# EAGLE design lightbuddy-transmitter (EAGLE 7.2.0)
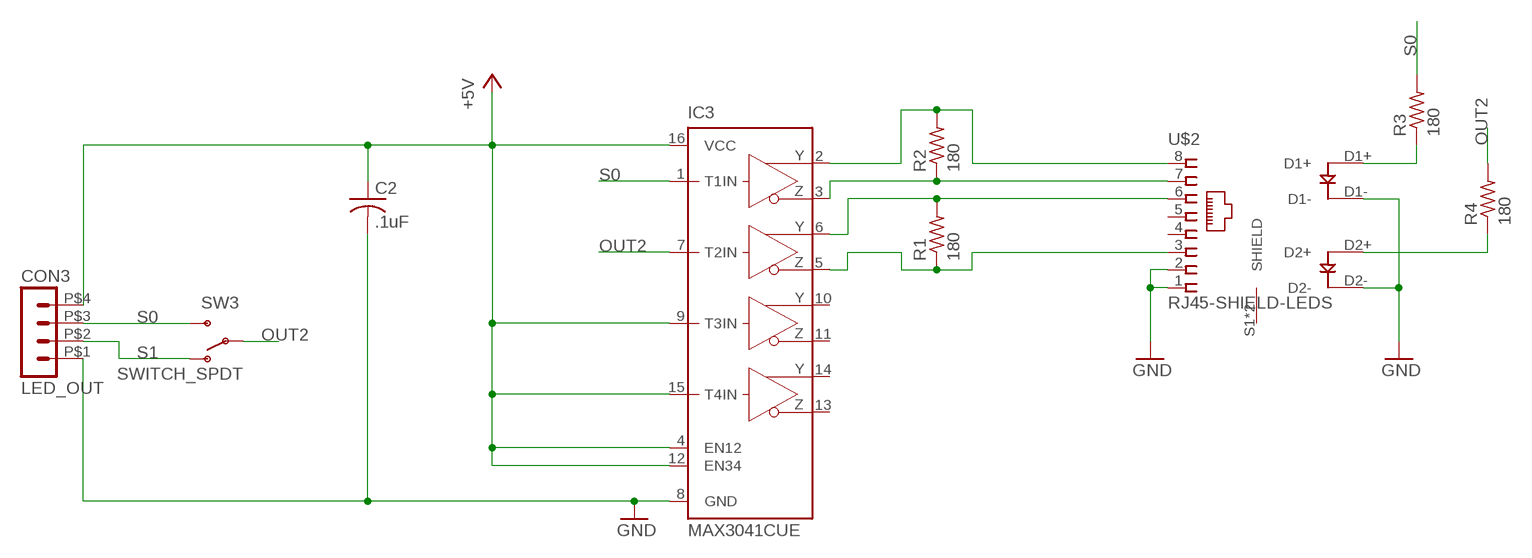
[diagram p0: schematic, sheet 1]

## Parts
C2  .1uF  C-USC0603  [C0603]
CON3  LED_OUT  4-PIN_DUPONT  [DUPONT-4P]
IC3  MAX3041CUE  [TSSOP16]
R1  180  R-US_R0603  [R0603]
R2  180  R-US_R0603  [R0603]
R3  180  R-US_R0603  [R0603]
R4  180  R-US_R0603  [R0603]
SW3  SWITCH_SPDT  [SWITCH_6P-2POS]
U$2  RJ45-SHIELD-LEDS  [RJ45-SHIELD-LEDS-ALT]

## Nets
+5V: C2.1 CON3.P$4 IC3.4(EN12) IC3.9(T3IN) IC3.12(EN34) IC3.15(T4IN) IC3.16(VCC)
GND: C2.2 CON3.P$1 IC3.8(GND) U$2.1 U$2.2 U$2.D1- U$2.D2-
N$1: R3.1 U$2.D1+
N$5: R4.1 U$2.D2+
N$14: IC3.5(Z2) R1.1 U$2.3
N$19: IC3.2(Y1) R2.2 U$2.8
N$20: IC3.3(Z1) R2.1 U$2.7
N$21: IC3.6(Y2) R1.2 U$2.6
OUT2: IC3.7(T2IN) R4.2 SW3.P0(P) SW3.P1(P)
S0: CON3.P$3 IC3.1(T1IN) R3.2 SW3.S0(S) SW3.S1(S)
S1: CON3.P$2 SW3.O0(O) SW3.O1(O)
Unconnected: IC3.10(Y3) IC3.11(Z3) IC3.13(Z4) IC3.14(Y4) U$2.4 U$2.5 U$2.S1(SHIELD) U$2.S2(SHIELD)

## Library data of the parts
C2 = adafruit:C-US: CAPACITOR, American symbol
CON3 = blinkinlabs:4-PIN_DUPONT: PIN HEADER
IC3 = maxim:MAX30*: ±10kV ESD-Protected, Quad 5V RS-485/RS-422 Transmitters Source: www.maxim-ic.com .. MAX3040-MAX3045.pdf; MPN: MAX3041CUE+; OC_FARNELL: unknown; OC_NEWARK: 73K8525
R1-R4 = adafruit:R-US_: RESISTOR, American symbol
SW3 = blinkinlabs:SWITCH_SPDT
U$2 = LEDscape:RJ45-SHIELD-LEDS

## Net classes
1 power: width 0.254 mm, drill 0.35 mm

## Board
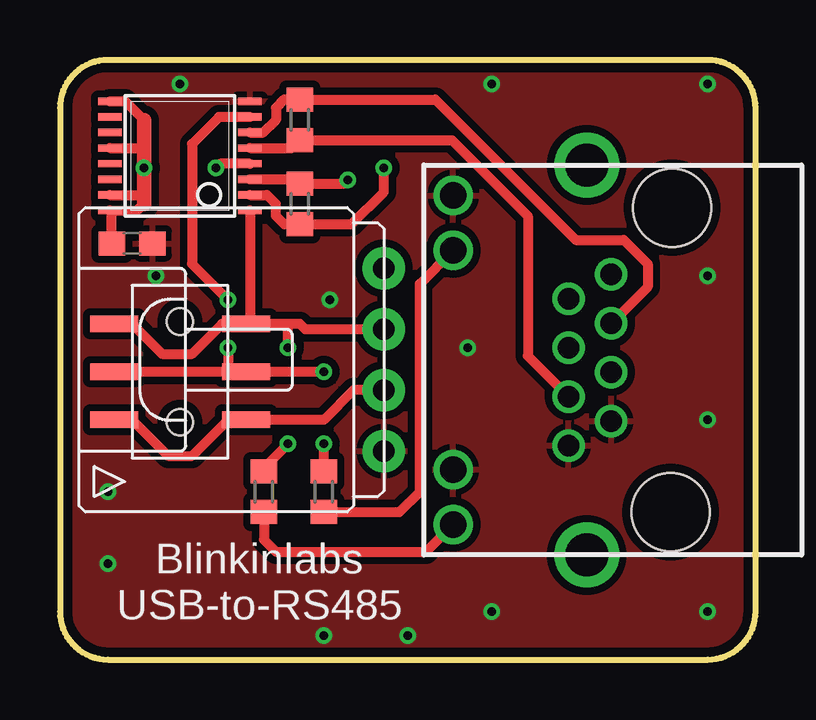
[diagram p1: board, top side]
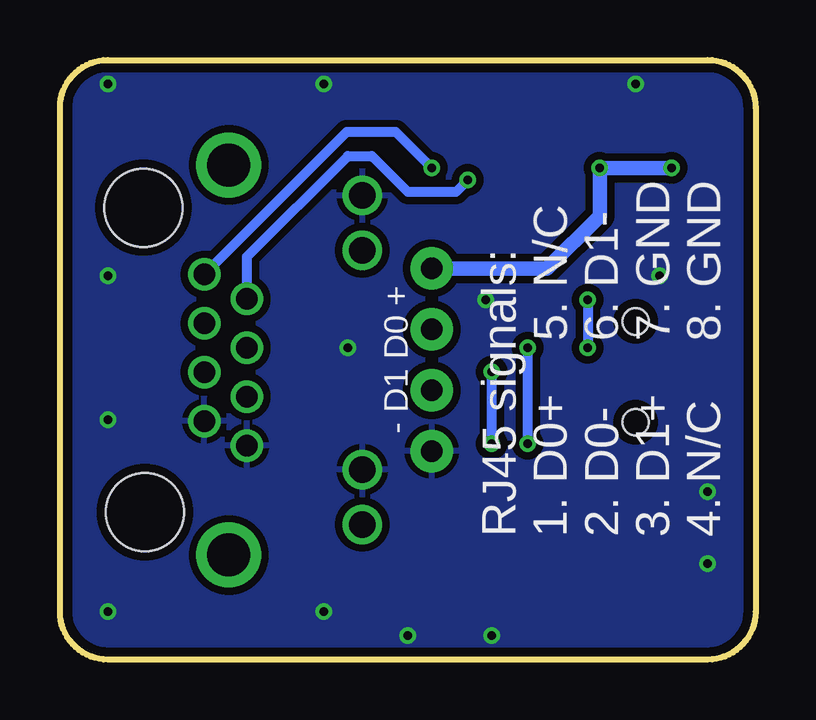
[diagram p2: board, bottom side, seen from below]

Size 29 x 25 mm. Coordinates in mm from the lower left corner, seen from the top.
Outline: 0,23 0,2 arc90 2,0 27,0 arc90 29,2 29,23 arc90 27,25 2,25 arc90 0,23
Copper layers (1*16): Top 0.0356mm / dielectric 1.5011mm / Bottom 0.0356mm
Design rules "LaenPCBOrder *": minimum track width 6mil, minimum drill 13mil, track to track 6mil, track to pad 6mil, pad to pad 6mil, via to via 6mil, smd to smd 6mil, copper to edge 15mil, drill to drill 6mil, minimum pad ring 7mil, minimum via ring 7mil, stop-mask expansion 4mil, vias tented up to drill 2mm, thermal gap 10mil

### Footprints (pad centres in the part's own frame; a part is rotated, then mirrored left to right if it is on the bottom)
C0603 = smd 1.1 x 1: 1 -0.85,0; 2 0.85,0
DUPONT-4P = drill 0.9 pad 1.778: P$1 -3.81,0; P$2 -1.27,0; P$3 1.27,0; P$4 3.81,0
TSSOP16 = smd 0.305 x 0.991: 1 -2.275,-2.918; 2 -1.625,-2.918; 3 -0.975,-2.918; 4 -0.325,-2.918; 5 0.325,-2.918; 6 0.975,-2.918; 7 1.625,-2.918; 8 2.275,-2.918; 9 2.275,2.918; 10 1.625,2.918; 11 0.975,2.918; 12 0.325,2.918; 13 -0.325,2.918; 14 -0.975,2.918; 15 -1.625,2.918; 16 -2.275,2.918
R0603 = smd 1 x 1.1: 1 -0.85,0; 2 0.85,0
SWITCH_6P-2POS = smd 0.7 x 2: O0 -2,2.75; O1 -2,-2.75; P0 0,2.75; P1 0,-2.75; S0 2,2.75; S1 2,-2.75 | hole 1.1: -2.1,0; 2.1,0
RJ45-SHIELD-LEDS-ALT = drill 0.9: 1 -3.57,0.76; 2 -2.55,-1.02; 3 -1.53,0.76; 4 -0.51,-1.02; 5 0.51,0.76; 6 1.53,-1.02; 7 2.55,0.76; 8 3.57,-1.02 | drill 1.1: D1+ -6.86,5.57; D1- -4.57,5.57; D2+ 4.57,5.57; D2- 6.86,5.57 | drill 1.8: S1 -8.13,0; S2 8.13,0 | hole 3.25: -6.35,-3.5; 6.35,-3.56

### Placement (x,y rotation side)
C2  3.01,17.35 0 top
CON3  13.5,12.5 90 top
IC3  5,21 90 top
R1  10,22.5 90 top
R2  10,19 270 top
R3  8.5,7 90 top
R4  11,7 90 top
SW3  5,12 90 top
U$2  21.96,12.49 90 top

### Tracks (layer width: path | path; a pad name or v marks a point on that pad's centre or on a via)
+5V  (via drill 0.35)
  Top 0.406: IC3.9 2.72,23.27 3.5,22.5 | IC3.12 3.33,21.32 3.5,21.5 | IC3.15 3.38,19.38 3.5,19.5 | 3.5,19 3.22,18.73 IC3.16 2.16,18.65 C2.1 | IC3.4 6.68,20.68 v6.5,20.5
  Top 0.61: 3.5,22.5 3.5,21.5 v3.5,20.5 3.5,19.5 3.5,19
  Bottom 0.61: CON3.P$4 8.69,16.31 6.5,18.5 6.5,20 v6.5,20.5 v3.5,20.5
GND  (via drill 0.35)
  other vias: 2,4 2,7 11,1 14.5,1 18,2 27,2 27,10 27,16 27,24 18,24 5,24 4,16 11.25,15 17,13
  pour Bottom (isolate 0.305): 0,0 0,25 29,25 29,0
  pour Top (isolate 0.305): 0,0 0,25 29,25 29,0
N$1
  Top 0.406: R3.1 8.5,5 9,4.5 15.26,4.5 U$2.D1+
N$5
  Top 0.406: R4.1 14.15,6.15 15,7 15,15.67 U$2.D2+
N$14
  Top 0.406: U$2.3 19.5,12.66 19.5,18.5 16.35,21.65 R1.1 9.68,21.32 IC3.5
N$19  (via drill 0.35)
  Top 0.406: v13.5,20.5 13.5,19.5 12.15,18.15 R2.2 9.35,18.15 9,18.5 9,19 8.62,19.38 IC3.2
  Bottom 0.406: v13.5,20.5 15,22 17.04,22 U$2.8
N$20  (via drill 0.35)
  Top 0.406: v12,20 11.85,19.85 R2.1 9.82,20.02 IC3.3
  Bottom 0.406: v12,20 12.5,19.5 14.5,19.5 16,21 17,21 21.2,16.8 U$2.7
N$21
  Top 0.406: U$2.6 24.5,15.54 24.5,16.5 23.5,17.5 21.5,17.5 15.65,23.35 R1.2 9.35,23.35 9,23 9,22.5 8.47,21.98 IC3.6
OUT2  (via drill 0.35)
  Top 0.406: 7,12 SW3.P1 v11,12 | 7,12 SW3.P0 | IC3.7 6.62,22.62 5.5,21.5 5.5,16.5 v7,15 | v7,13 7,12 | R4.2 v11,9
  Bottom 0.406: v7,15 v7,13 | v11,9 v11,12
S0  (via drill 0.35)
  Top 0.406: CON3.P$3 10.23,13.77 10,14 9.5,14 | 9.5,14 SW3.S1 | SW3.S0 3,14 4.25,12.75 5.5,12.75 6.75,14 SW3.S1 | IC3.1 7.92,14.17 SW3.S1 | R3.2 8.5,8 v9.5,9 | v9.5,13 9.5,14
  Bottom 0.406: v9.5,9 v9.5,13
S1
  Top 0.406: CON3.P$2 12.23,11.23 11,10 SW3.O1 7,10 5.5,8.5 4.5,8.5 3,10 SW3.O0

### Text on the board
tNames: Blinkinlabs / USB-to-RS485
bNames: 5. N/C / 6. D1- / 7. GND / 8. GND | - D1 D0 + | RJ45 signals: / 1. D0+ / 2. D0- / 3. D1+ / 4. N/C